# Altium schematic sheet MAIN.SCHDOC
size B
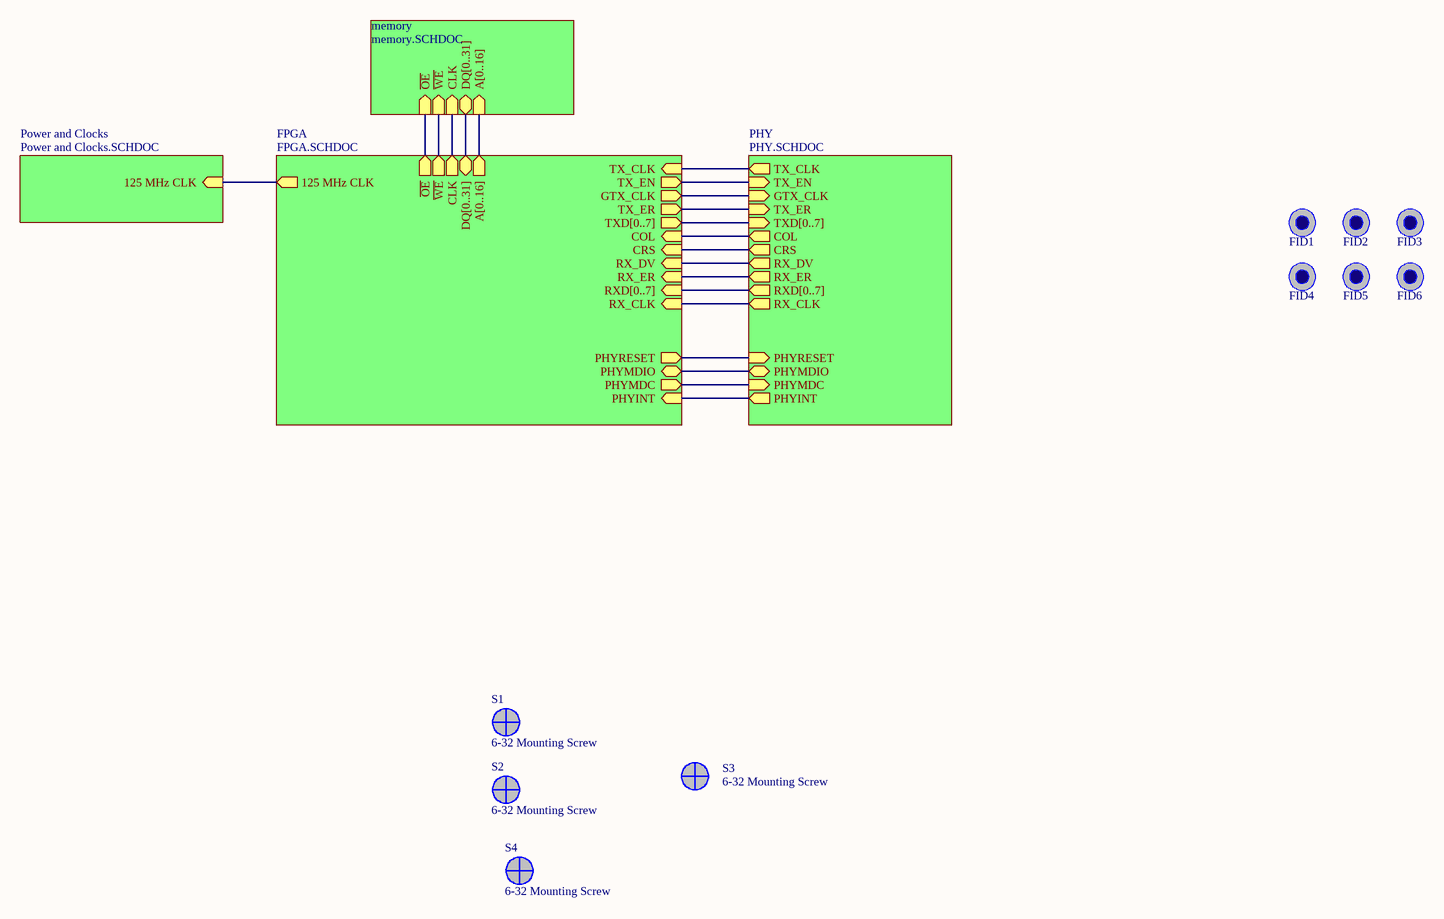
[diagram p0: MAIN.SCHDOC]

## Parts
FID1  FIDUCIAL  [FIDUCIAL]  (value not drawn)
FID2  FIDUCIAL  [FIDUCIAL]  (value not drawn)
FID3  FIDUCIAL  [FIDUCIAL]  (value not drawn)
FID4  FIDUCIAL  [FIDUCIAL]  (value not drawn)
FID5  FIDUCIAL  [FIDUCIAL]  (value not drawn)
FID6  FIDUCIAL  [FIDUCIAL]  (value not drawn)
S1  6-32 Mounting Screw  [SCREW6-32]
S2  6-32 Mounting Screw  [SCREW6-32]
S3  6-32 Mounting Screw  [SCREW6-32]
S4  6-32 Mounting Screw  [SCREW6-32]

## Sub-sheets
FPGA = FPGA.SCHDOC: CRS (in), COL (in), TX_CLK (in), TX_EN (out), GTX_CLK (out), TX_ER (out), TXD[0..7] (out), RX_CLK (in), RXD[0..7] (in), RX_ER (in), RX_DV (in), PHYMDC (out), PHYMDIO (bidir), PHYINT (in), DQ[0..31] (bidir), A[0..16] (out), CLK (out), ~{WE} (out), ~{OE} (out), 125 MHz CLK (out), PHYRESET (out)
memory = memory.SCHDOC: DQ[0..31] (bidir), A[0..16] (in), CLK (in), ~{WE} (in), ~{OE} (in)
PHY = PHY.SCHDOC: PHYRESET (in), CRS (out), COL (out), TX_CLK (out), TX_EN (in), GTX_CLK (in), TX_ER (in), TXD[0..7] (in), RX_CLK (out), RXD[0..7] (out), RX_ER (out), RX_DV (out), PHYMDC (in), PHYMDIO (bidir), PHYINT (out)
Power and Clocks = Power and Clocks.SCHDOC: 125 MHz CLK (in)

## Nets
(unnamed): sheet FPGA/CRS, sheet PHY/CRS
(unnamed): sheet FPGA/COL, sheet PHY/COL
(unnamed): sheet FPGA/TX_CLK, sheet PHY/TX_CLK
(unnamed): sheet FPGA/TX_EN, sheet PHY/TX_EN
(unnamed): sheet FPGA/GTX_CLK, sheet PHY/GTX_CLK
(unnamed): sheet FPGA/TX_ER, sheet PHY/TX_ER
(unnamed): sheet FPGA/RX_CLK, sheet PHY/RX_CLK
(unnamed): sheet FPGA/RX_ER, sheet PHY/RX_ER
(unnamed): sheet FPGA/RX_DV, sheet PHY/RX_DV
(unnamed): sheet FPGA/PHYMDC, sheet PHY/PHYMDC
(unnamed): sheet FPGA/PHYMDIO, sheet PHY/PHYMDIO
(unnamed): sheet FPGA/PHYINT, sheet PHY/PHYINT
(unnamed): sheet FPGA/CLK, sheet memory/CLK
(unnamed): sheet FPGA/~{WE}, sheet memory/~{WE}
(unnamed): sheet FPGA/~{OE}, sheet memory/~{OE}
(unnamed): sheet FPGA/125 MHz CLK, sheet Power and Clocks/125 MHz CLK
(unnamed): sheet FPGA/PHYRESET, sheet PHY/PHYRESET

## Buses and harness runs
bus sheet FPGA/A[0..16] = sheet memory/A[0..16]
bus sheet FPGA/DQ[0..31] = sheet memory/DQ[0..31]
bus sheet FPGA/RXD[0..7] = sheet PHY/RXD[0..7]
bus sheet FPGA/TXD[0..7] = sheet PHY/TXD[0..7]

## Library data of the parts
S1-S4 = MNTSCREW